# EAGLE design Kuga (EAGLE 7.6.0)
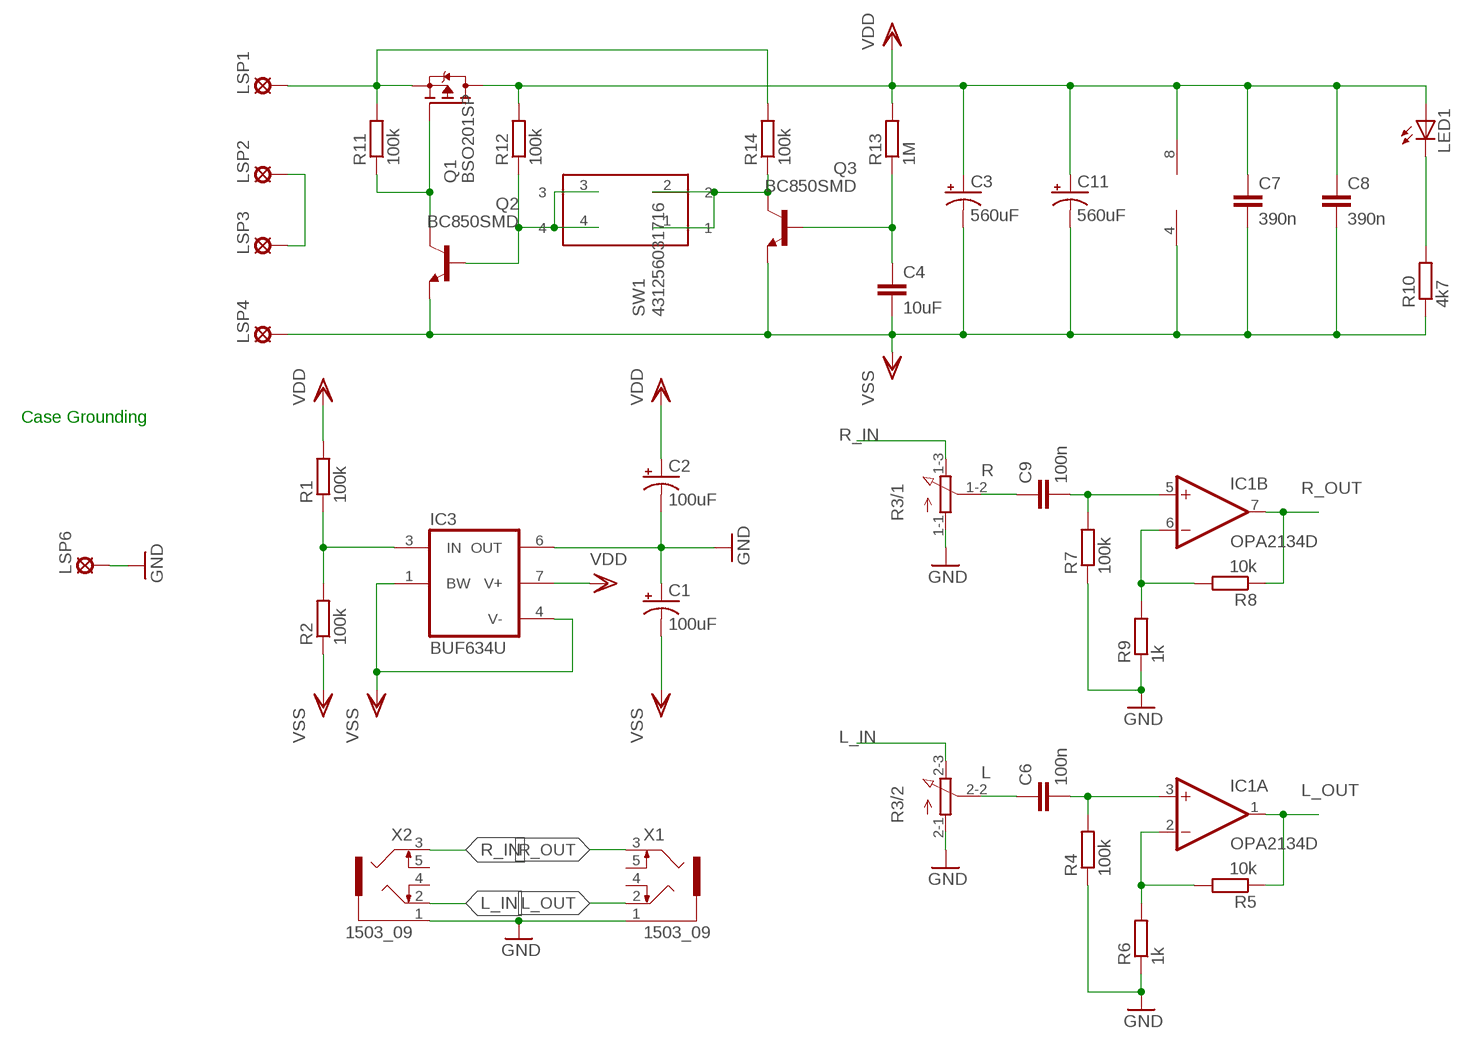
[diagram p0: schematic, sheet 1]

## Parts
C1  100uF  100UF-POLAR-25V-20%(ELEC)  [PANASONIC_D]
C2  100uF  100UF-POLAR-25V-20%(ELEC)  [PANASONIC_D]
C3  560uF  560UF-PANASONIC_G-25V-20%  [PANASONIC_G]
C4  10uF  10UF-1210-50V-20%  [1210]
C6  100n  C-EUC1206  [C1206]
C7  390n  C-EUC1206  [C1206]
C8  390n  C-EUC1206  [C1206]
C9  100n  C-EUC1206  [C1206]
C11  560uF  560UF-PANASONIC_G-25V-20%  [PANASONIC_G]
IC1  OPA2134D  [SOIC8]
IC3  BUF634U  [SO08]
LED1  LED3MM  [LED3MM]
LSP1  LSP10  [LSP10]
LSP2  LSP10  [LSP10]
LSP3  LSP10  [LSP10]
LSP4  LSP10  [LSP10]
LSP6  LSP10  [LSP10]
Q1  BSO201SP  [SO-8]
Q2  BC850SMD  [SOT23-BEC]
Q3  BC850SMD  [SOT23-BEC]
R1  100k  R-EU_R1206  [R1206]
R2  100k  R-EU_R1206  [R1206]
R3  3RP/1610G  [3RP/1610G]
R4  100k  R-EU_R1206  [R1206]
R5  10k  R-EU_R1206  [R1206]
R6  1k  R-EU_R1206  [R1206]
R7  100k  R-EU_R1206  [R1206]
R8  10k  R-EU_R1206  [R1206]
R9  1k  R-EU_R1206  [R1206]
R10  4k7  R-EU_R1206  [R1206]
R11  100k  R-EU_R1206  [R1206]
R12  100k  R-EU_R1206  [R1206]
R13  1M  R-EU_R1206  [R1206]
R14  100k  R-EU_R1206  [R1206]
SW1  431256031716  [431256031716]
X1  1503_09  [1503_09]
X2  1503_09  [1503_09]

## Nets
GND: C1.+ C2.- IC3.6(OUT) LSP6.MP R3.1-1(/1:A) R3.2-1(/2:A) R4.1 R6.1 R7.1 R9.1 X1.1 X2.1
L: C6.1 R3.2-2(/2:S)
L_IN: R3.2-3(/2:E) X2.2
L_OUT: IC1.1(A:OUT) R5.1 X1.2
N$1: LED1.K(C) R10.2
N$2: C6.2 IC1.3(A:+IN) R4.2
N$3: IC1.2(A:-IN) R5.2 R6.2
N$4: C9.2 IC1.5(B:+IN) R7.2
N$5: IC3.3(IN) R1.1 R2.2
N$6: IC1.6(B:-IN) R8.2 R9.2
N$7: LSP1.MP Q1.1(S) Q1.2(S) Q1.3(S) R11.2 R14.2
N$8: Q2.B R12.1 SW1.3 SW1.4
N$9: Q1.4(G) Q2.C R11.1
N$12: C4.1 Q3.B R13.1
N$14: Q3.C R14.1 SW1.1 SW1.2
R: C9.1 R3.1-2(/1:S)
R_IN: R3.1-3(/1:E) X2.3
R_OUT: IC1.7(B:OUT) R8.1 X1.3
VDD: C2.+ C3.+ C7.1 C8.1 C11.+ IC1.8(P:V+) IC3.7(V+) LED1.A Q1.5(D) Q1.6(D) Q1.7(D) Q1.8(D) R1.2 R12.2 R13.2
VSS: C1.- C3.- C4.2 C7.2 C8.2 C11.- IC1.4(P:V-) IC3.1(BW) IC3.4(V-) LSP4.MP Q2.E Q3.E R2.1 R10.1
~BAT: LSP2.MP LSP3.MP
Unconnected: X1.4 X1.5 X2.4 X2.5

## Notes on the sheet
- Case Grounding

## Library data of the parts
C1 C2 = SparkFun-Capacitors:100UF-POLAR: 100µF polarized capacitors A capacitor is a passive two-terminal electrical component used to store electrical energy temporarily in an electric field.; PROD_ID: CAP-12547
C3 C11 = SparkFun-Capacitors:560UF: 560µF polarized capacitors A capacitor is a passive two-terminal electrical component used to store electrical energy temporarily in an electric field.; PROD_ID: CAP-09983
C4 = SparkFun-Capacitors:10UF: 10.0µF ceramic capacitors A capacitor is a passive two-terminal electrical component used to store electrical energy temporarily in an electric field.; PROD_ID: CAP-09824
C6-C9 = rcl:C-EU: CAPACITOR, European symbol
IC1 = linear:OPA2134: SoundPLUS (TM) High Performance AUDIO OPERATIONAL AMPLIFIERS Source: http://focus.ti.com/lit/ds/sbos058/sbos058.pdf
IC3 = burr-brown:BUF634: 250mA High-Speed Buffer; MF: TEXAS INSTRUMENTS; MPN: BUF634U; OC_FARNELL: 4733617; OC_NEWARK: 27C6567
LED1 = led:LED: LED OSRAM: - CHIPLED LG R971, LG N971, LY N971, LG Q971, LY Q971, LO R971, LY R971 LH N974, LH R974 LS Q976, LO Q976, LY Q976 LO Q996 - Hyper CHIPLED LW Q18S LB Q993, LB Q99A, LB R99A - SideLED LS A670, LO A670, LY A670, LG A670, LP A670 LB A673, LV A673, LT A673, LW A673 LH A674 LY A675 LS A676, LA A676, LO A676, LY A676, LW A676 LS A679, LY A679, LG A679 - Hyper Micro SIDELED® LS Y876, LA Y876, LO Y876, LY Y876 LT Y87S - SmartLED LW L88C, LW L88S LB L89C, LB L89S, LG L890 LS L89K, LO L89K, LY L89K LS L896, LA L896, LO L896, LY L896 - TOPLED LS T670, LO T670, LY T670, LG T670, LP T670 LSG T670, LSP T670, LSY T670, LOP T670, LYG T670 LG T671, LOG T671, LSG T671 LB T673, LV T673, LT T673, LW T673 LH T674 LS T676, LA T676, LO T676, LY T676, LB T676, LH T676, LSB T676, LW T676 LB T67C, LV T67C, LT T67C, LS T67K, LO T67K, LY T67K, LW E67C LS E67B, LA E67B, LO E67B, LY E67B, LB E67C, LV E67C, LT E67C LW T67C LS T679, LY T679, LG T679 LS T770, LO T770, LY T770, LG T770, LP T770 LB T773, LV T773, LT T773, LW T773 LH T774 LS E675, LA E675, LY E675, LS T675 LS T776, LA T776, LO T776, LY T776, LB T776 LHGB T686 LT T68C, LB T68C - Hyper Mini TOPLED® LB M676 - Mini TOPLED Santana® LG M470 LS M47K, LO M47K, LY M47K Source: http://www.osram.convergy.de LUXEON: - LUMILED® LXK2-PW12-R00, LXK2-PW12-S00, LXK2-PW14-U00, LXK2-PW14-V00 LXK2-PM12-R00, LXK2-PM12-S00, LXK2-PM14-U00 LXK2-PE12-Q00, LXK2-PE12-R00, LXK2-PE12-S00, LXK2-PE14-T00, LXK2-PE14-U00 LXK2-PB12-K00, LXK2-PB12-L00, LXK2-PB12-M00, LXK2-PB14-N00, LXK2-PB14-P00, LXK2-PB14-Q00 LXK2-PR12-L00, LXK2-PR12-M00, LXK2-PR14-Q00, LXK2-PR14-R00 LXK2-PD12-Q00, LXK2-PD12-R00, LXK2-PD12-S00 LXK2-PH12-R00, LXK2-PH12-S00 LXK2-PL12-P00, LXK2-PL12-Q00, LXK2-PL12-R00 Source: www.luxeon.com KINGBRIGHT: KA-3528ASYC Source: www.kingbright.com
LSP1-LSP4 LSP6 = solpad:LSP10: SOLDER PAD drill 1.0 mm, distributor Buerklin, 12H555
Q1 = transistor-fet:BSO201SP: OptiMOS(R)-P Small-Signal-Transistor P-Channel, Enhancement mode, Super Logic Level (2.5 V rated) RDS(on) 8mOhm, ID -14.9 a Source: http://www.infineon.com/upload/Document/cmc_upload/documents/011/3655/BSO201SP_211201.pdf
Q2 Q3 = transistor-npn:BC850*: NPN Transistor
R1 R2 R4-R14 = rcl:R-EU_: RESISTOR, European symbol
R3 = pot:3RP/1610G: 16mm Potentiometer two level Source: http://www.alphapotentiometers.net/html/16mm_pot_2.html
SW1 = Switches_rev16a:431256031716: WS-TST, 6*6mm right angle Tact switch,THT, height 3.15mm, 4 pins, black actuator, 160gf
X1 X2 = con-lumberg:1503_09: Jack connectors according to JISC 6560, 3.5 mm Klinkeneinbaukupplung nach JISC 6560, 3,5 mm, 3-polig/ stereo, abgewinkelte Ausführung, mit 2 Öffnern und Lötaugen, für Leiterplatten Rückseitenmontage Source: http://www.lumberg.com/Produkte/PDFs/1503_09.pdf; OC_FARNELL: 1243244; OC_NEWARK: unknown

## Board
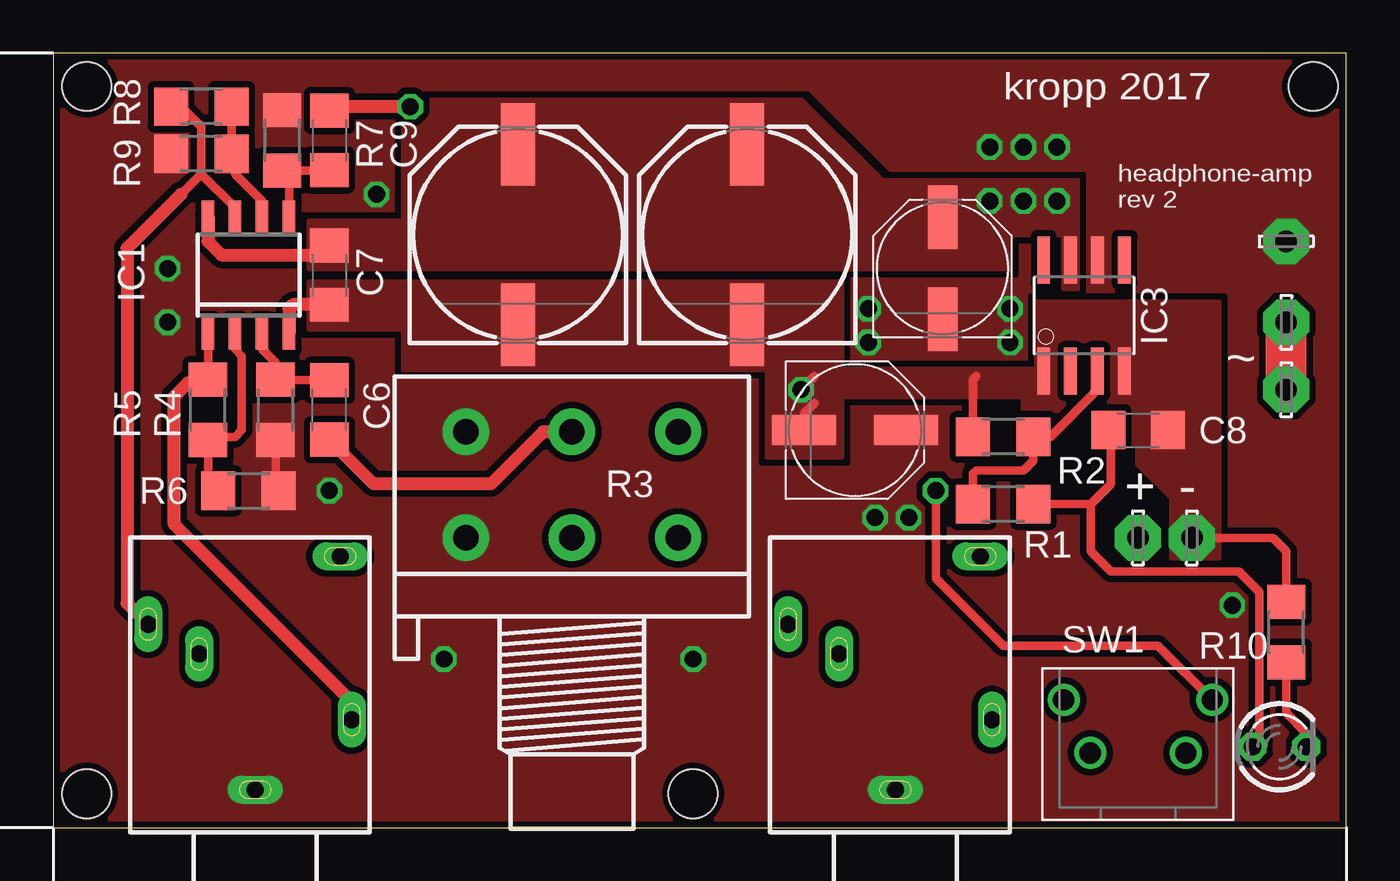
[diagram p1: board, top side]
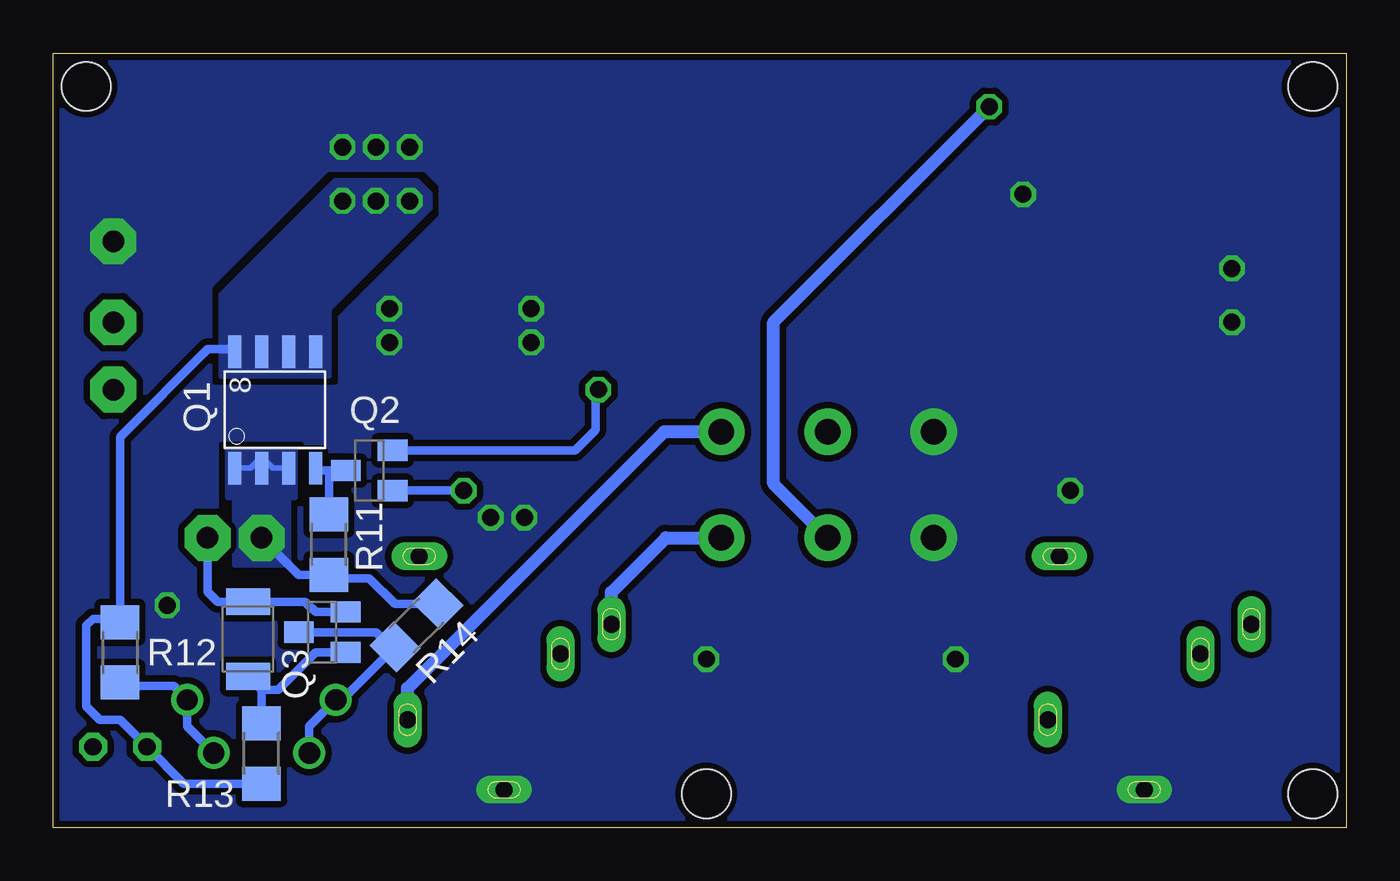
[diagram p2: board, bottom side, seen from below]

Size 60.94 x 36.5 mm. Coordinates in mm from the lower left corner, seen from the top.
Outline: 0,0 60.94,0 60.94,36.5 0,36.5 0,0
Copper layers (1*16): Top 0.035mm / dielectric 1.5mm / Bottom 0.035mm
Design rules "SeeedStudio_2layer_DRU_no_angle_20140221": minimum track width 6mil, minimum drill 12mil, track to track 6mil, track to pad 6mil, pad to pad 6mil, via to via 6mil, smd to smd 0mil, copper to edge 10mil, drill to drill 10mil, minimum pad ring 10mil, minimum via ring 6mil, stop-mask expansion 2mil, vias tented up to drill 100mil, thermal gap 10mil
Holes 2.3 mm at 59.37,34.92 30.16,1.59 1.59,34.92 1.59,1.59

### Footprints (pad centres in the part's own frame; a part is rotated, then mirrored left to right if it is on the bottom)
PANASONIC_D = smd 3 x 1.4: + 2.4,0; - -2.4,0
PANASONIC_G = smd 3.9 x 1.6: + 4.25,0; - -4.25,0
1210 = smd 1.27 x 2.06: 1 -1.755,0; 2 1.755,0
C1206 = smd 1.6 x 1.8: 1 -1.4,0; 2 1.4,0
SOIC8 = smd 0.6 x 1.5: 1 -1.905,-2.75; 2 -0.635,-2.75; 3 0.635,-2.75; 4 1.905,-2.75; 5 1.905,2.75; 6 0.635,2.75; 7 -0.635,2.75; 8 -1.905,2.75
SO08 = smd 0.61 x 2.21: 1 -1.905,-2.616; 2 -0.635,-2.616; 3 0.635,-2.616; 4 1.905,-2.616; 5 1.905,2.616; 6 0.635,2.616; 7 -0.635,2.616; 8 -1.905,2.616
LED3MM = drill 0.813 octagon: A -1.27,0; K 1.27,0
LSP10 = drill 1.016 pad 2.159 octagon: MP 0,0
SO-8 = smd 1.524 x 0.61: 1 -2.743,1.905; 2 -2.743,0.635; 3 -2.743,-0.635; 4 -2.743,-1.905; 5 2.743,-1.905; 6 2.743,-0.635; 7 2.743,0.635; 8 2.743,1.905
SOT23-BEC = smd 1 x 1.4: B -0.95,-1.1; C 0,1.1; E 0.95,-1.1
R1206 = smd 1.6 x 1.803: 1 -1.422,0; 2 1.422,0
3RP/1610G = drill 1.2 pad 2.184: 1-1 -5,0; 1-2 0,0; 1-3 5,0; 2-1 -5,5; 2-2 0,5; 2-3 5,5
431256031716 = drill 1: 1 -3.5,1.25; 2 -2.25,-1.25; 3 2.25,-1.25; 4 3.5,1.25
1503_09 = drill 0.8 pad 1.2 long: 1 0,-2.1; 2 -4.55,-5.4; 3 5.05,-9.9; 4 -4,-13.1; 5 2.65,-8.5

### Placement (x,y rotation side)
C1  37.78,18.73 0 top
C2  41.91,26.35 90 top
C3  32.7,27.94 90 top
C4  51.75,8.89 90 bottom
C6  13.02,19.69 90 top
C7  13.02,26.04 270 top
C8  51.12,18.73 0 top
C9  13.02,32.38 270 top
C11  21.91,27.94 90 top
IC1  9.21,26.04 0 top
IC3  48.58,24.13 0 top
LED1  57.79,3.81 0 top
LSP1  51.12,13.65 90 top
LSP2  58.1,23.81 90 top
LSP3  58.1,20.64 90 top
LSP4  53.66,13.65 90 top
LSP6  58.1,27.62 0 top
Q1  50.48,19.69 90 bottom
Q2  46.04,16.83 90 bottom
Q3  48.26,9.21 90 bottom
R1  44.77,15.24 0 top
R2  44.77,18.42 0 top
R3  24.45,13.65 0 top
R4  10.48,19.69 90 top
R5  7.3,19.69 270 top
R6  9.21,15.87 180 top
R7  10.79,32.38 270 top
R8  6.99,33.97 0 top
R9  6.99,31.75 0 top
R10  58.1,9.21 270 top
R11  47.94,13.33 270 bottom
R12  57.79,8.25 90 bottom
R13  51.12,3.49 270 bottom
R14  43.82,9.52 45 bottom
SW1  51.12,4.76 0 top
X1  9.53,-0.32 180 top
X2  39.69,-0.32 180 top

### Tracks (layer width: path | path; a pad name or v marks a point on that pad's centre or on a via)
GND  (via drill 0.8)
  Top 0.406: R4.1 10.48,15.87 R6.1
  other vias: 38.42,24.45 38.42,22.86 45.09,24.45 45.09,22.86 18.41,7.94 30.16,7.94 38.73,14.6 40.32,14.6 44.13,32.07 45.72,32.07 47.31,32.07 5.4,23.81 5.4,26.35 15.24,29.85 13.02,15.87 55.56,10.48
  pour Top (isolate 0.305, rank 3, no thermals): -0.95,40.32 61.28,40.32 61.28,-0.32 -0.95,-0.32
  pour Bottom (isolate 0.305, rank 2, no thermals): -0.95,40.32 61.28,40.32 61.28,-0.32 -0.95,-0.32
L
  Top 0.61: R3.2-2 23.1,18.65 20.64,16.19 15.11,16.19 C6.1
L_IN
  Bottom 0.61: R3.2-3 32.15,18.65 44.24,6.56 X2.2
L_OUT
  Top 0.406: IC1.1 R5.1
  Top 0.61: X1.2 14.07,5.93 5.71,14.29 5.71,20.32 6.35,20.96 7.15,20.96 R5.1
N$1
  Top 0.406: LED1.K 59.05,4.45 58.1,5.4 R10.2
N$2
  Top 0.406: C6.2 10.48,21.08 R4.2 10.48,21.91 9.84,22.54 IC1.3
N$3
  Top 0.406: R6.2 7.3,15.87 R5.2 7.45,18.42 8.57,18.42 8.89,18.73 8.89,22.23 8.57,22.54 IC1.2
N$4
  Top 0.406: IC1.5 11.11,30.65 R7.2 13,30.96 C9.2
N$5
  Top 0.406: R1.1 43.35,16.68 43.5,16.83 45.72,16.83 46.19,17.3 R2.2 46.99,18.42 49.21,20.64 IC3.3
N$6
  Top 0.406: IC1.6 9.84,29.53 8.57,30.8 8.57,31.58 R9.2 R8.2
N$7
  Bottom 0.254: Q1.3 50.6,16.94 51.12,17.46 51.64,16.94 Q1.1
  Bottom 0.406: R14.2 44.82,10.53 46.04,11.75 47.78,11.75 R11.2 49.38,11.91 LSP1.MP
  pour Bottom (isolate 0.254, no thermals): 49.85,12.38 49.85,15.56 49.53,15.56 49.53,17.78 52.7,17.78 52.7,15.56 52.39,15.56 52.39,12.38
N$8  (via drill 0.8)
  Top 0.406: v41.59,15.87 41.59,11.75 44.77,8.57 52.06,8.57 SW1.4
  Bottom 0.406: SW1.3 54.62,4.76 SW1.4 54.62,6.04 55.25,6.67 57.62,6.67 R12.1 | Q2.B v41.59,15.88 v41.59,15.87
N$9
  Bottom 0.406: R11.1 47.94,16.83 | 47.94,16.83 Q2.C | 47.94,16.83 48.46,16.83 Q1.4
N$12
  Bottom 0.406: R13.1 51.12,6.5 | 51.12,6.5 C4.1 | 51.12,6.5 50.33,6.5 48.58,8.25 Q3.B
N$14
  Bottom 0.406: Q3.C 45.72,9.21 45.03,8.52 R14.1 47.33,6.01 SW1.1 48.87,4.76 SW1.2
R  (via drill 0.8)
  Top 0.61: v16.83,33.97 13.21,33.97 C9.1
  Bottom 0.61: R3.1-2 26.99,16.19 26.99,23.81 v16.83,33.97
R_IN
  Bottom 0.61: X2.3 34.64,11.08 32.07,13.65 R3.1-3
R_OUT
  Top 0.406: IC1.7 8.57,29.21 6.99,30.8 | 6.99,30.8 6.99,33.02 6.03,33.97 R8.1 | 6.99,30.8 6.03,29.85
  Top 0.61: 6.03,29.85 3.49,27.3 3.49,10.57 X1.3
VDD  (via drill 0.8)
  Top 0.406: R1.2 48.9,15.24 | 48.9,15.24 49.85,16.19 49.85,18.6 C8.1 | 48.9,15.24 48.9,13.02 49.85,12.07 55.88,12.07 56.83,11.11 56.83,4.13 LED1.A
  Top 0.61: IC1.8 7.3,27.62 7.94,26.99 12.57,26.99 C7.1
  Bottom 0.406: R13.2 54.78,2.07 LED1.A 57.79,5.08 58.74,5.08 59.37,5.71 59.37,9.52 59.05,9.84 57.95,9.84 R12.2 57.79,18.42 53.66,22.54 52.5,22.54 Q1.8
  other vias: 44.13,29.53 45.72,29.53 47.31,29.53
  pour Top (isolate 0.305, rank 2, no thermals): 12.06,26.35 12.06,28.57 16.51,28.57 16.51,34.29 35.24,34.29 39.05,30.48 48.26,30.48 48.26,25.4 47.62,25.4 47.62,27.94 45.09,27.94 45.09,26.35
  pour Bottom (isolate 0.254, no thermals): 48.58,21.27 53.02,21.27 53.02,24.45 53.02,25.08 47.62,30.48 43.82,30.48 43.18,29.85 43.18,29.21 47.94,24.45 47.94,21.27
VSS  (via drill 0.8)
  Top 0.406: R2.1 43.35,21.12 43.5,21.27 | C1.- 35.38,19.51 35.88,20 | R10.1 58.1,13.02 57.47,13.65 LSP4.MP | v35.24,20.64 35.88,21.27
  Top 0.61: C7.2 11.3,24.64 11.11,24.45 IC1.4
  Bottom 0.406: Q3.E 48.58,10.16 49.06,10.65 C4.2 53.19,10.65 53.66,11.11 LSP4.MP | Q2.E 36.34,17.78 C1.- 35.38,20.5 v35.24,20.64
  pour Top (isolate 0.305, rank 2, no thermals): 12.06,25.72 12.06,23.5 16.51,23.5 16.51,21.59 33.66,21.59 33.66,17.46 37.15,17.46 37.15,20.32 45.72,20.32 45.72,17.14 46.99,17.14 46.99,22.54 46.36,22.54 46.36,21.59 37.15,21.59 37.15,25.72
  pour Top (isolate 0.305, rank 2, no thermals): 46.36,22.54 46.36,24.77 54.93,24.77 54.93,12.7 52.7,12.7 52.7,15.56 51.12,17.14 51.12,18.1 46.99,18.1 46.99,22.54
~BAT
  Top 1.93: LSP3.MP LSP2.MP

### Text on the board
tPlace: kropp 2017 | headphone-amp / rev 2 | ~ | + | -